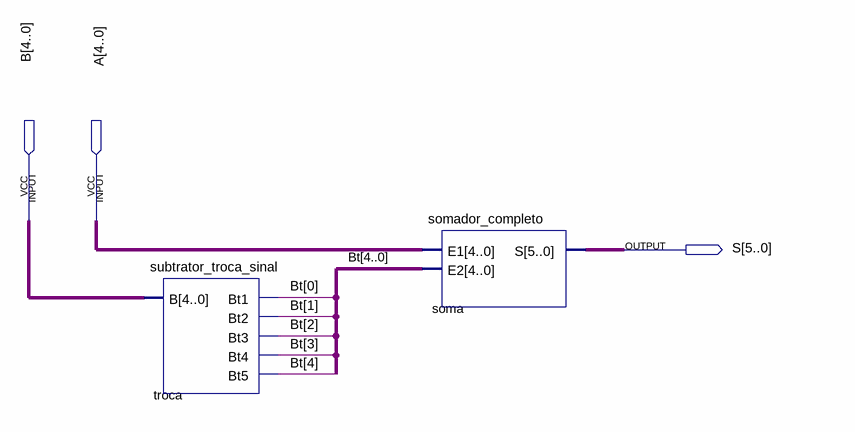
[diagram p0: schematic sheet]
// Quartus schematic subtrator_teste.bdf as structural Verilog: 2 symbols, 3 pins
module subtrator_teste (
  input  [4:0] B,
  input  [4:0] A,
  output [5:0] S
);

  wire [4:0] Bt;

  subtrator_troca_sinal troca (.B(B), .Bt1(Bt[0]), .Bt2(Bt[1]), .Bt3(Bt[2]), .Bt4(Bt[3]), .Bt5(Bt[4]));
  somador_completo soma (.E1(A), .E2(Bt), .S(S));
endmodule
